# EasyEDA schematic SoundSystem-V0.2.1.json
TITLE: SoundSystem; REV: 0.2.1; Date: 2026-06-08; Sheet: 1/1; Company: Zakary CHAUVE
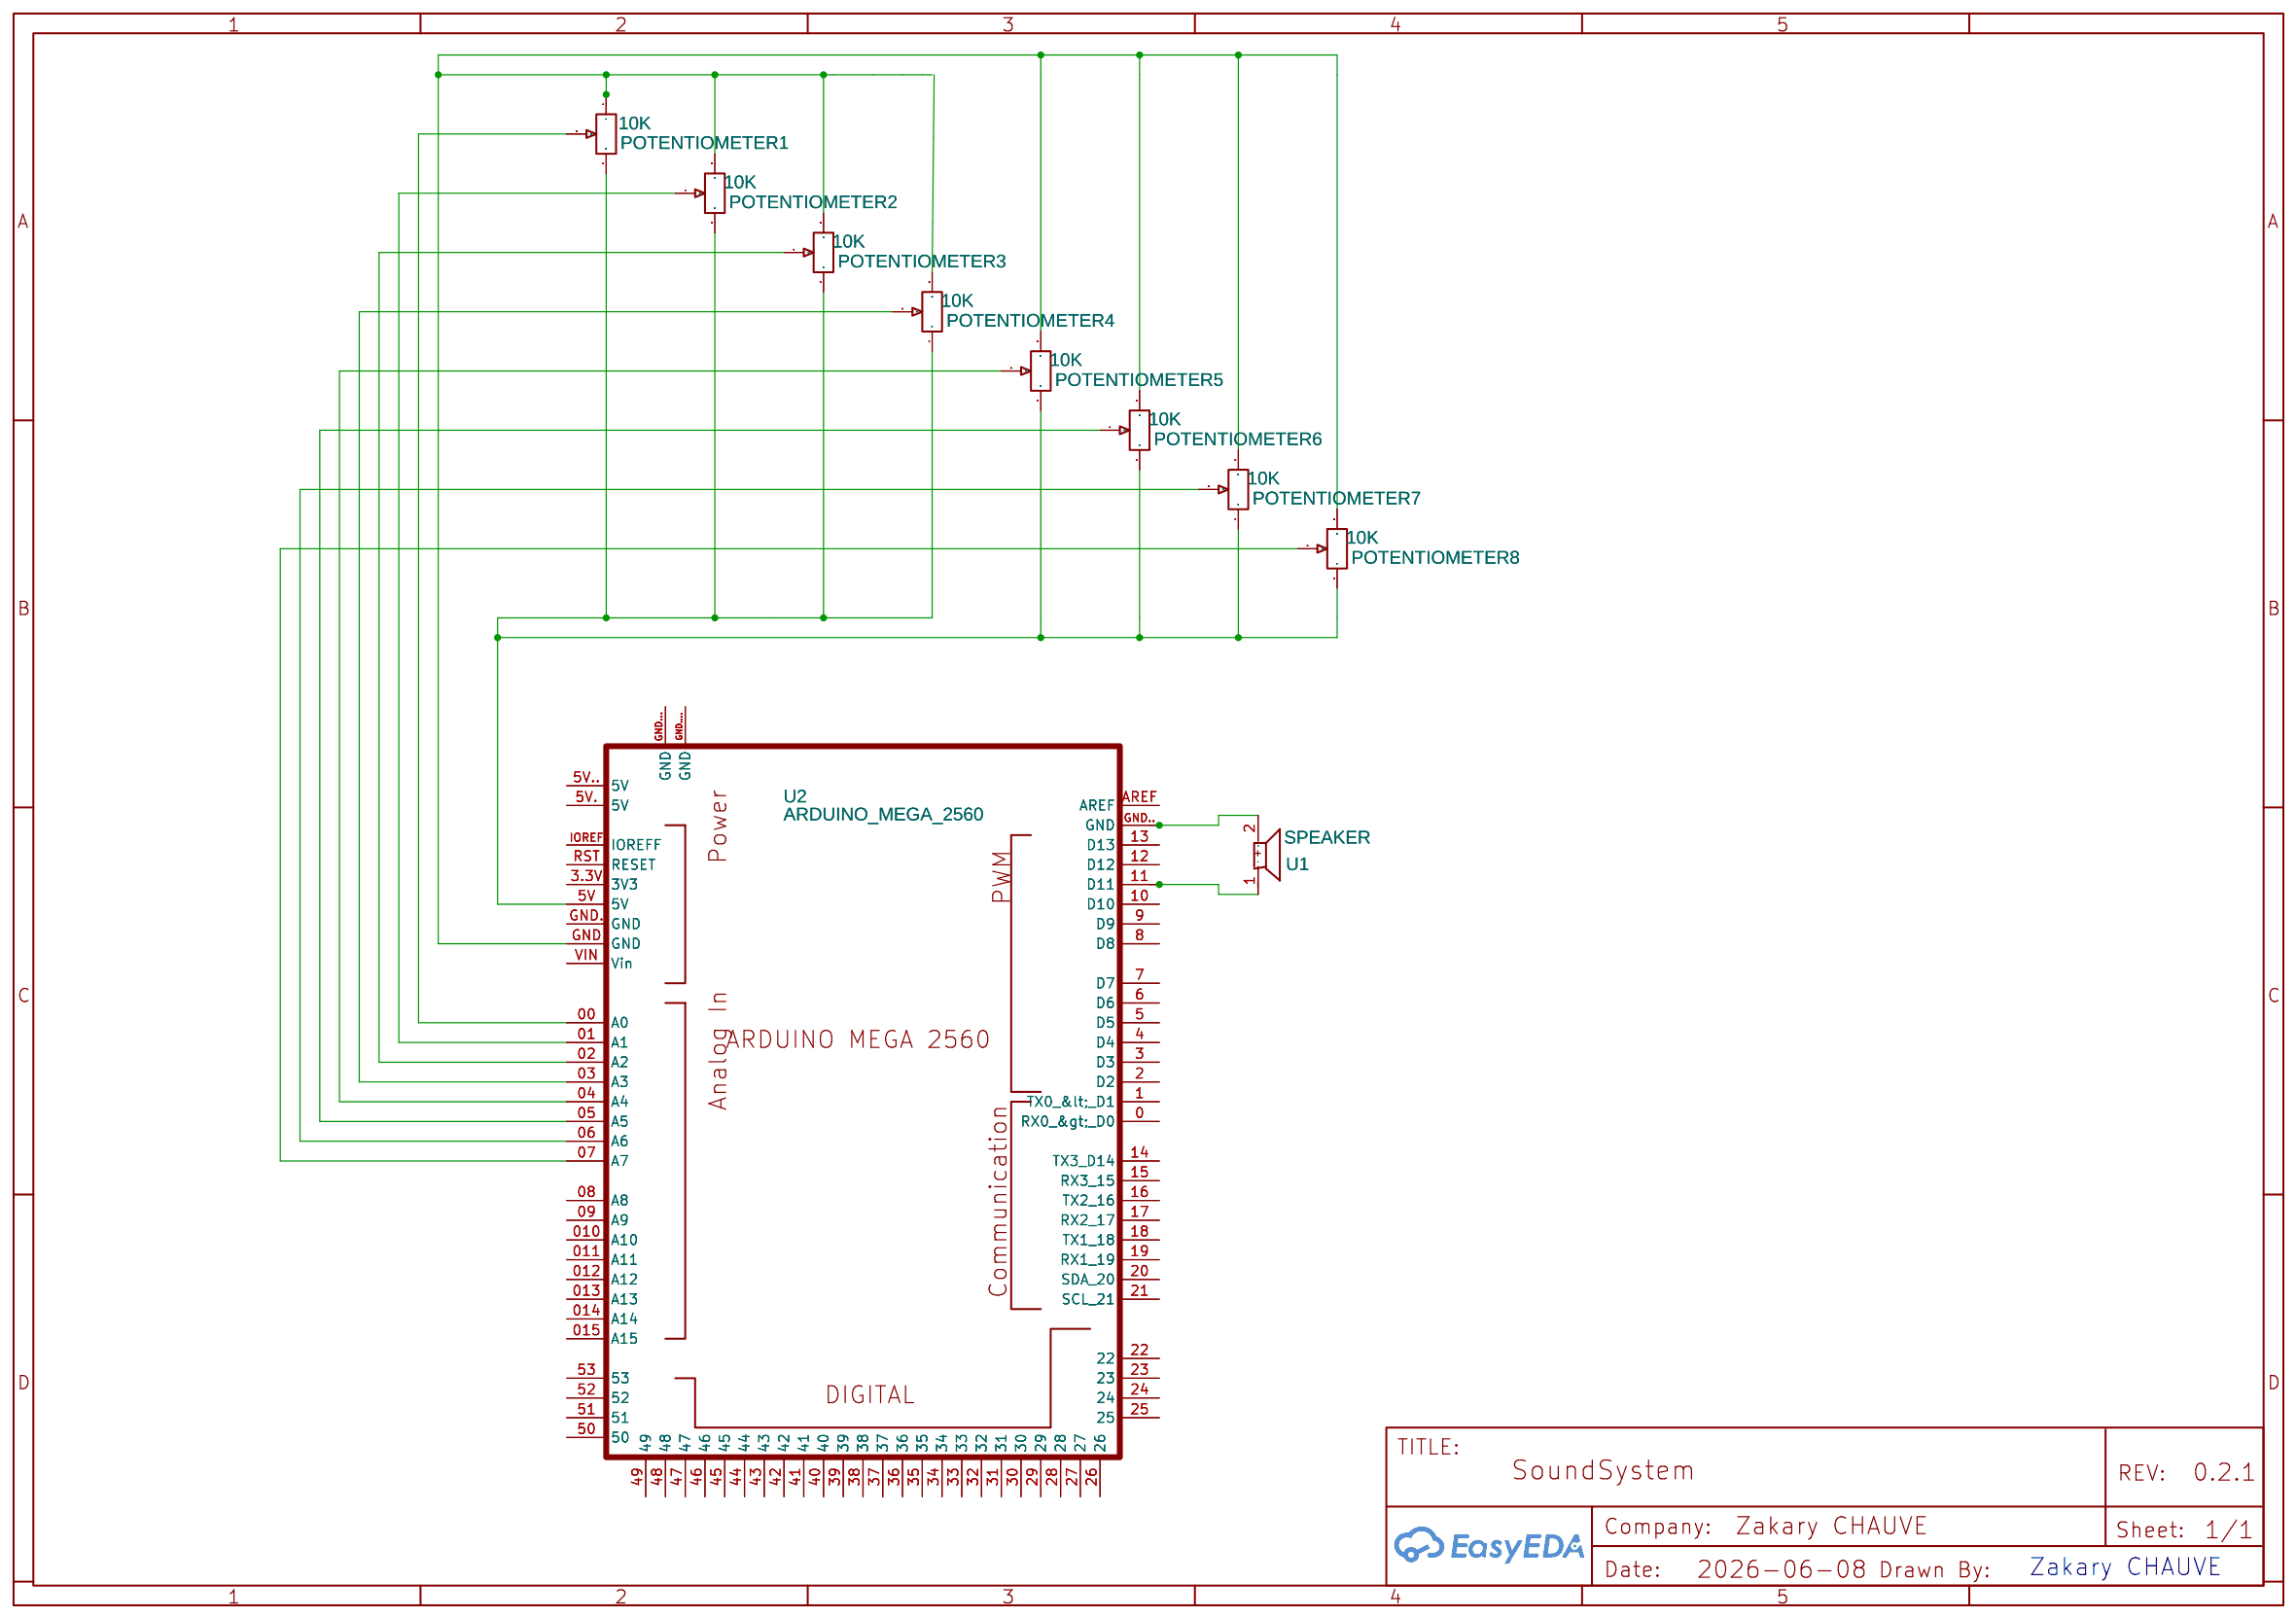
[diagram p0: schematic sheet]

## Parts
POTENTIOMETER1  10K  [POT-10K-POTENTIOMETER]
POTENTIOMETER2  10K  [POT-10K-POTENTIOMETER]
POTENTIOMETER3  10K  [POT-10K-POTENTIOMETER]
POTENTIOMETER4  10K  [POT-10K-POTENTIOMETER]
POTENTIOMETER5  10K  [POT-10K-POTENTIOMETER]
POTENTIOMETER6  10K  [POT-10K-POTENTIOMETER]
POTENTIOMETER7  10K  [POT-10K-POTENTIOMETER]
POTENTIOMETER8  10K  [POT-10K-POTENTIOMETER]
U1  SPEAKER  [SPEAKER]
U2  ARDUINO_MEGA_2560  [TWIX_MEGA_PCB____ARDUINO-MEGA2560-FOOTPRINT_]

## Library data of the parts
POTENTIOMETER1-POTENTIOMETER8 = Pot-10k-Potentiometer: Supplier: LCSC; Manufacturer: JML; Manufacturer Part: Potentiometer WH160-1-104; Supplier Part: C61836; Contributor: RafiqueUddinMazumder
U1 = speaker: Contributor: daphnequinonesladroma
U2 = ARDUINO_MEGA_2560 COPY: Contributor: kenwayofali; Package Display: No

## Nets
Net-(POTENTIOMETER1-1): POTENTIOMETER1.1 POTENTIOMETER2.3 POTENTIOMETER3.3 POTENTIOMETER5.3 POTENTIOMETER6.3 POTENTIOMETER7.3 POTENTIOMETER8.3 U2.GND
Net-(POTENTIOMETER1-2): POTENTIOMETER1.2 U2.00(A0)
Net-(POTENTIOMETER1-3): POTENTIOMETER1.3 POTENTIOMETER2.1 POTENTIOMETER3.1 POTENTIOMETER4.1 POTENTIOMETER5.1 POTENTIOMETER6.1 POTENTIOMETER7.1 POTENTIOMETER8.1 U2.5V
Net-(POTENTIOMETER2-2): POTENTIOMETER2.2 U2.01(A1)
Net-(POTENTIOMETER3-2): POTENTIOMETER3.2 U2.02(A2)
Net-(POTENTIOMETER4-2): POTENTIOMETER4.2 U2.03(A3)
Net-(POTENTIOMETER5-2): POTENTIOMETER5.2 U2.04(A4)
Net-(POTENTIOMETER6-2): POTENTIOMETER6.2 U2.05(A5)
Net-(POTENTIOMETER7-2): POTENTIOMETER7.2 U2.06(A6)
Net-(POTENTIOMETER8-2): POTENTIOMETER8.2 U2.07(A7)
Net-(U1-1): U1.1(-) U2.11(D11)
Net-(U1-2): U1.2(+) U2.GND..(GND)

Not connected (* = marked no-connect by the designer): POTENTIOMETER4 3; U2 0(RX0 > D0) 1(TX0 < D1) 2(D2) 3(D3) 3.3V(3V3) 4(D4) 5(D5) 5V.(5V) 5V..(5V) 6(D6) 7(D7) 08(A8) 8(D8) 09(A9) 9(D9) 010(A10) 10(D10) 011(A11) 012(A12) 12(D12) 013(A13) 13(D13) 014(A14) 14(TX3 D14) 015(A15) 15(RX3 15) 16(TX2 16) 17(RX2 17) 18(TX1 18) 19(RX1 19) 20(SDA 20) 21(SCL 21) 22 23 24 25 26 27 28 29 30 31 32 33 34 35 36 37 38 39 40 41 42 43 44 45 46 47 48 49 50 51 52 53 AREF GND.(GND) GND...(GND) GND....(GND) IOREF(IOREFF) RST(RESET) VIN(Vin)

## Notes on the sheet
- Zakary CHAUVE
